# EAGLE schematic 10m02 (EAGLE 6.5.0)
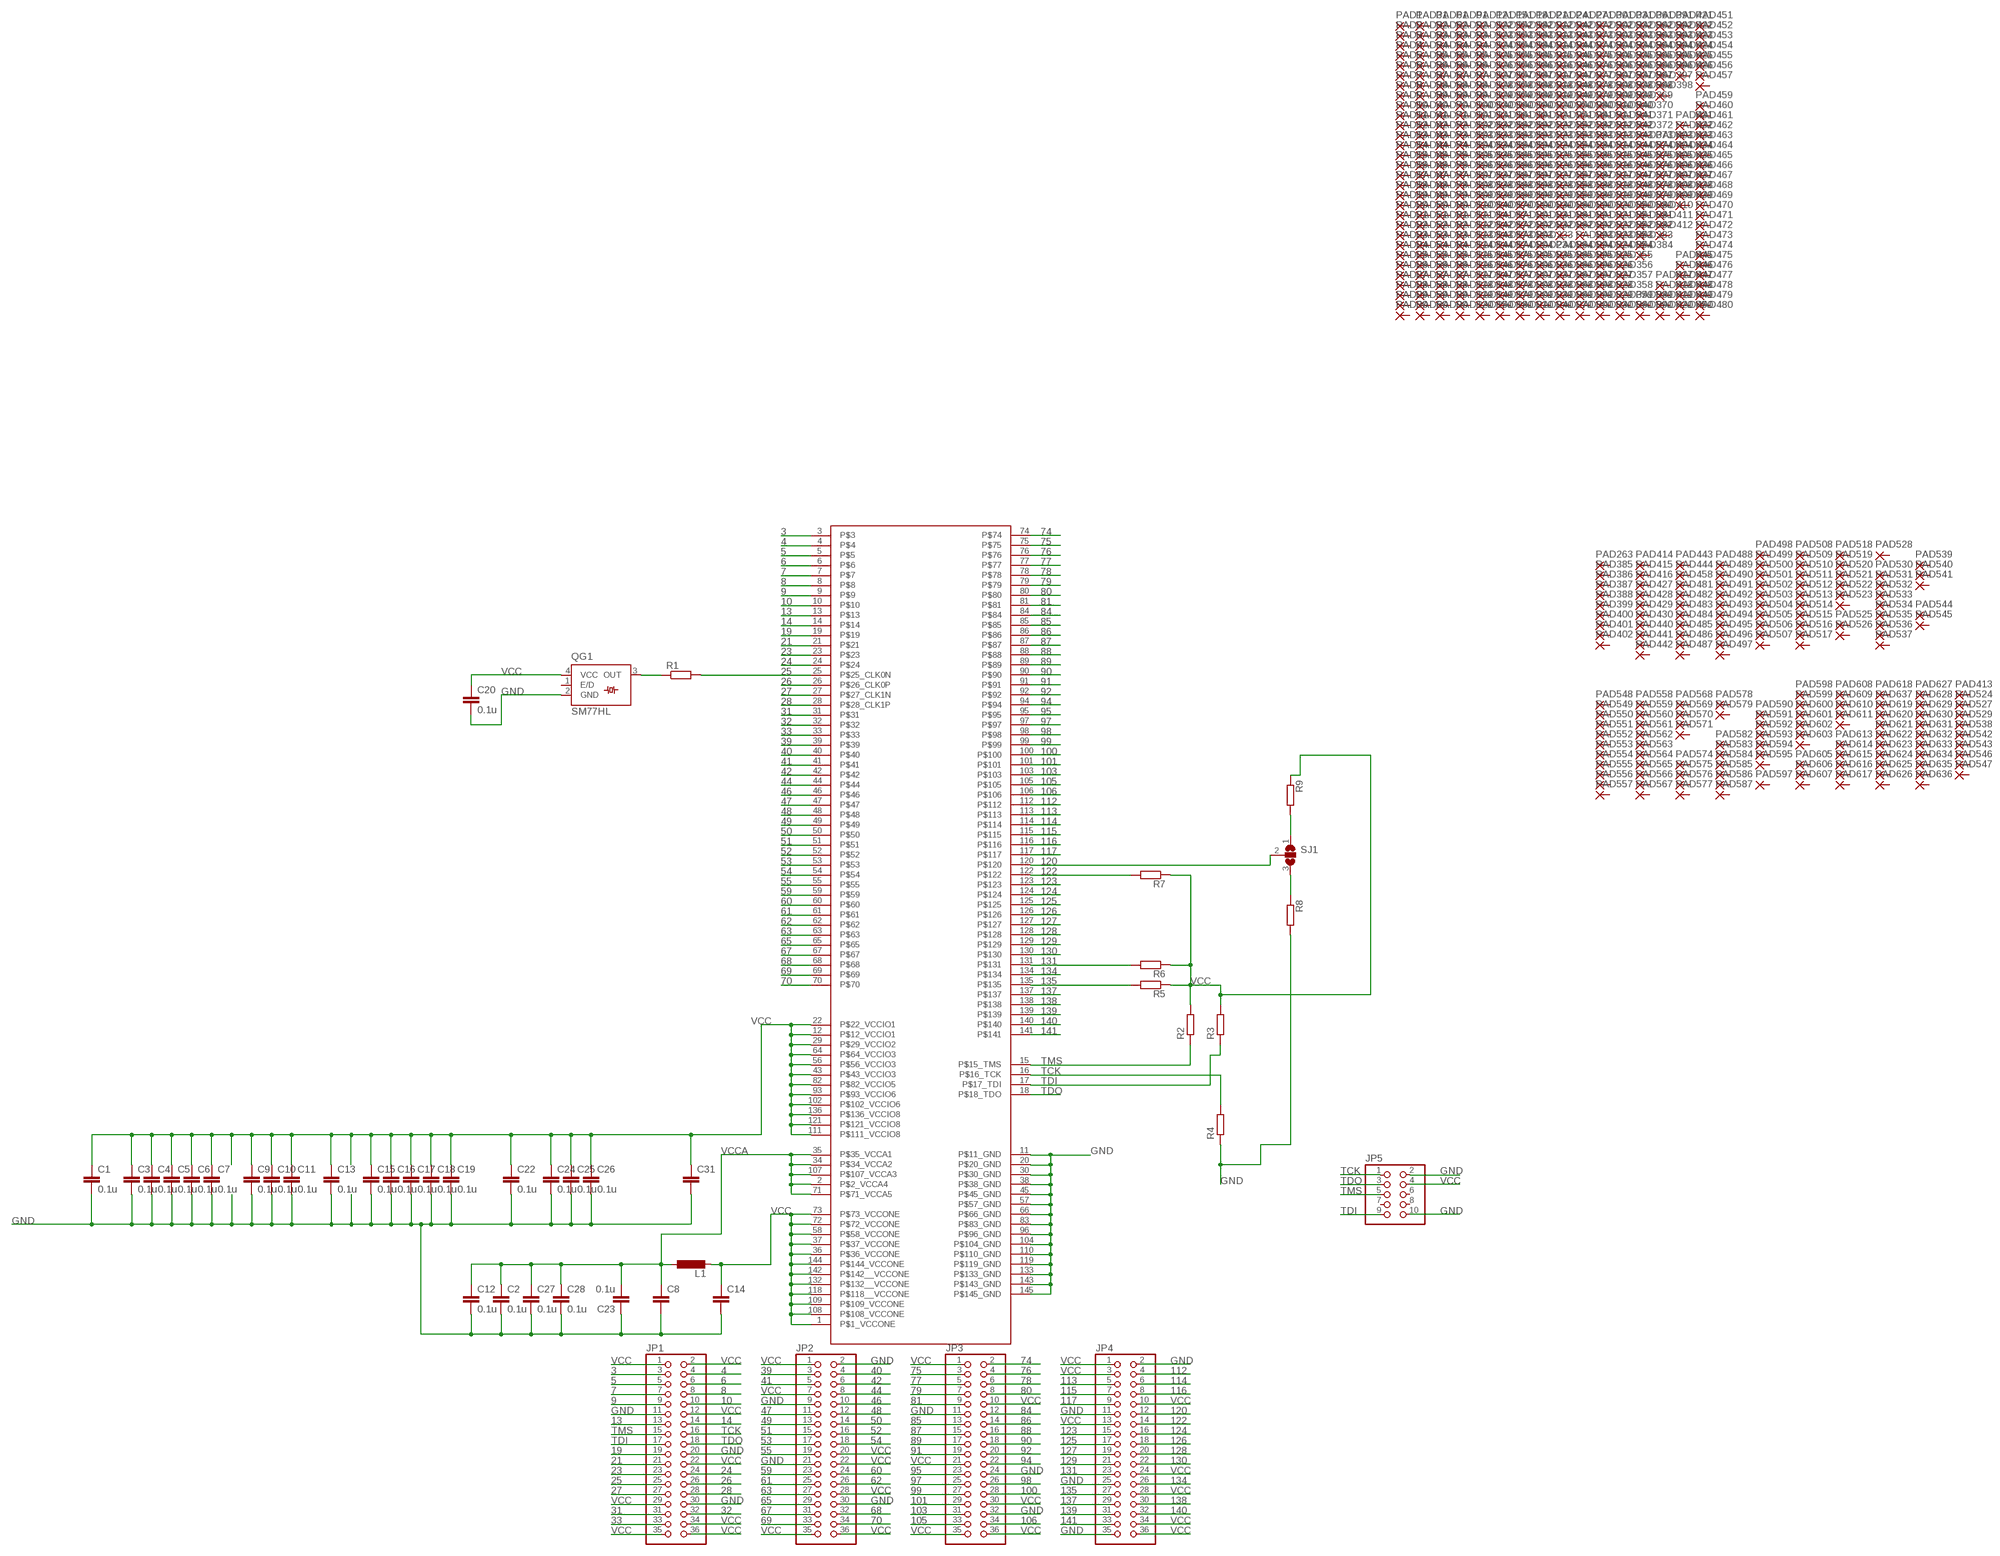
[diagram p0: schematic, sheet 1]

## Parts
C1  0.1u  C-EUC0603K  [C0603K]
C2  0.1u  C-EUC0603K  [C0603K]
C3  0.1u  C-EUC0603K  [C0603K]
C4  0.1u  C-EUC0603K  [C0603K]
C5  0.1u  C-EUC0603K  [C0603K]
C6  0.1u  C-EUC0603K  [C0603K]
C7  0.1u  C-EUC0603K  [C0603K]
C8  C-EUC3216  [C3216]
C9  0.1u  C-EUC0603K  [C0603K]
C10  0.1u  C-EUC0603K  [C0603K]
C11  0.1u  C-EUC0603K  [C0603K]
C12  0.1u  C-EUC0603K  [C0603K]
C13  0.1u  C-EUC0603K  [C0603K]
C14  C-EUC3216  [C3216]
C15  0.1u  C-EUC0603K  [C0603K]
C16  0.1u  C-EUC0603K  [C0603K]
C17  0.1u  C-EUC0603K  [C0603K]
C18  0.1u  C-EUC0603K  [C0603K]
C19  0.1u  C-EUC0603K  [C0603K]
C20  0.1u  C-EUC0603K  [C0603K]
C22  0.1u  C-EUC0603K  [C0603K]
C23  0.1u  C-EUC0603K  [C0603K]
C24  0.1u  C-EUC0603K  [C0603K]
C25  0.1u  C-EUC0603K  [C0603K]
C26  0.1u  C-EUC0603K  [C0603K]
C27  0.1u  C-EUC0603K  [C0603K]
C28  0.1u  C-EUC0603K  [C0603K]
C31  C-EUC3225  [C3225]
IC1  10M02SC144  [TQFP144G]
JP1  PINHD-2X18  [2X18]
JP2  PINHD-2X18  [2X18]
JP3  PINHD-2X18  [2X18]
JP4  PINHD-2X18  [2X18]
JP5  PINHD-2X5  [2X05]
L1  L-EUL3216C  [L3216C]
PAD1  1,6/0,9  [1,6/0,9]
PAD2  1,6/0,9  [1,6/0,9]
PAD3  1,6/0,9  [1,6/0,9]
PAD4  1,6/0,9  [1,6/0,9]
PAD5  1,6/0,9  [1,6/0,9]
PAD6  1,6/0,9  [1,6/0,9]
PAD7  1,6/0,9  [1,6/0,9]
PAD8  1,6/0,9  [1,6/0,9]
PAD9  1,6/0,9  [1,6/0,9]
PAD10  1,6/0,9  [1,6/0,9]
PAD11  1,6/0,9  [1,6/0,9]
PAD12  1,6/0,9  [1,6/0,9]
PAD13  1,6/0,9  [1,6/0,9]
PAD14  1,6/0,9  [1,6/0,9]
PAD15  1,6/0,9  [1,6/0,9]
PAD16  1,6/0,9  [1,6/0,9]
PAD17  1,6/0,9  [1,6/0,9]
PAD18  1,6/0,9  [1,6/0,9]
PAD19  1,6/0,9  [1,6/0,9]
PAD20  1,6/0,9  [1,6/0,9]
PAD21  1,6/0,9  [1,6/0,9]
PAD22  1,6/0,9  [1,6/0,9]
PAD23  1,6/0,9  [1,6/0,9]
PAD24  1,6/0,9  [1,6/0,9]
PAD25  1,6/0,9  [1,6/0,9]
PAD26  1,6/0,9  [1,6/0,9]
PAD27  1,6/0,9  [1,6/0,9]
PAD28  1,6/0,9  [1,6/0,9]
PAD29  1,6/0,9  [1,6/0,9]
PAD30  1,6/0,9  [1,6/0,9]
PAD31  1,6/0,9  [1,6/0,9]
PAD32  1,6/0,9  [1,6/0,9]
PAD33  1,6/0,9  [1,6/0,9]
PAD34  1,6/0,9  [1,6/0,9]
PAD35  1,6/0,9  [1,6/0,9]
PAD36  1,6/0,9  [1,6/0,9]
PAD37  1,6/0,9  [1,6/0,9]
PAD38  1,6/0,9  [1,6/0,9]
PAD39  1,6/0,9  [1,6/0,9]
PAD40  1,6/0,9  [1,6/0,9]
PAD41  1,6/0,9  [1,6/0,9]
PAD42  1,6/0,9  [1,6/0,9]
PAD43  1,6/0,9  [1,6/0,9]
PAD44  1,6/0,9  [1,6/0,9]
PAD45  1,6/0,9  [1,6/0,9]
PAD46  1,6/0,9  [1,6/0,9]
PAD47  1,6/0,9  [1,6/0,9]
PAD48  1,6/0,9  [1,6/0,9]
PAD49  1,6/0,9  [1,6/0,9]
PAD50  1,6/0,9  [1,6/0,9]
PAD51  1,6/0,9  [1,6/0,9]
PAD52  1,6/0,9  [1,6/0,9]
PAD53  1,6/0,9  [1,6/0,9]
PAD54  1,6/0,9  [1,6/0,9]
PAD55  1,6/0,9  [1,6/0,9]
PAD56  1,6/0,9  [1,6/0,9]
PAD57  1,6/0,9  [1,6/0,9]
PAD58  1,6/0,9  [1,6/0,9]
PAD59  1,6/0,9  [1,6/0,9]
PAD60  1,6/0,9  [1,6/0,9]
PAD61  1,6/0,9  [1,6/0,9]
PAD62  1,6/0,9  [1,6/0,9]
PAD63  1,6/0,9  [1,6/0,9]
PAD64  1,6/0,9  [1,6/0,9]
PAD65  1,6/0,9  [1,6/0,9]
PAD66  1,6/0,9  [1,6/0,9]
PAD67  1,6/0,9  [1,6/0,9]
PAD68  1,6/0,9  [1,6/0,9]
PAD69  1,6/0,9  [1,6/0,9]
PAD70  1,6/0,9  [1,6/0,9]
PAD71  1,6/0,9  [1,6/0,9]
PAD72  1,6/0,9  [1,6/0,9]
PAD73  1,6/0,9  [1,6/0,9]
PAD74  1,6/0,9  [1,6/0,9]
PAD75  1,6/0,9  [1,6/0,9]
PAD76  1,6/0,9  [1,6/0,9]
PAD77  1,6/0,9  [1,6/0,9]
PAD78  1,6/0,9  [1,6/0,9]
PAD79  1,6/0,9  [1,6/0,9]
PAD80  1,6/0,9  [1,6/0,9]
PAD81  1,6/0,9  [1,6/0,9]
PAD82  1,6/0,9  [1,6/0,9]
PAD83  1,6/0,9  [1,6/0,9]
PAD84  1,6/0,9  [1,6/0,9]
PAD85  1,6/0,9  [1,6/0,9]
PAD86  1,6/0,9  [1,6/0,9]
PAD87  1,6/0,9  [1,6/0,9]
PAD88  1,6/0,9  [1,6/0,9]
PAD89  1,6/0,9  [1,6/0,9]
PAD90  1,6/0,9  [1,6/0,9]
PAD91  1,6/0,9  [1,6/0,9]
PAD92  1,6/0,9  [1,6/0,9]
PAD93  1,6/0,9  [1,6/0,9]
PAD94  1,6/0,9  [1,6/0,9]
PAD95  1,6/0,9  [1,6/0,9]
PAD96  1,6/0,9  [1,6/0,9]
PAD97  1,6/0,9  [1,6/0,9]
PAD98  1,6/0,9  [1,6/0,9]
PAD99  1,6/0,9  [1,6/0,9]
PAD100  1,6/0,9  [1,6/0,9]
PAD101  1,6/0,9  [1,6/0,9]
PAD102  1,6/0,9  [1,6/0,9]
PAD103  1,6/0,9  [1,6/0,9]
PAD104  1,6/0,9  [1,6/0,9]
PAD105  1,6/0,9  [1,6/0,9]
PAD106  1,6/0,9  [1,6/0,9]
PAD107  1,6/0,9  [1,6/0,9]
PAD108  1,6/0,9  [1,6/0,9]
PAD109  1,6/0,9  [1,6/0,9]
PAD110  1,6/0,9  [1,6/0,9]
PAD111  1,6/0,9  [1,6/0,9]
PAD112  1,6/0,9  [1,6/0,9]
PAD113  1,6/0,9  [1,6/0,9]
PAD114  1,6/0,9  [1,6/0,9]
PAD115  1,6/0,9  [1,6/0,9]
PAD116  1,6/0,9  [1,6/0,9]
PAD117  1,6/0,9  [1,6/0,9]
PAD118  1,6/0,9  [1,6/0,9]
PAD119  1,6/0,9  [1,6/0,9]
PAD120  1,6/0,9  [1,6/0,9]
PAD121  1,6/0,9  [1,6/0,9]
PAD122  1,6/0,9  [1,6/0,9]
PAD123  1,6/0,9  [1,6/0,9]
PAD124  1,6/0,9  [1,6/0,9]
PAD125  1,6/0,9  [1,6/0,9]
PAD126  1,6/0,9  [1,6/0,9]
PAD127  1,6/0,9  [1,6/0,9]
PAD128  1,6/0,9  [1,6/0,9]
PAD129  1,6/0,9  [1,6/0,9]
PAD130  1,6/0,9  [1,6/0,9]
PAD131  1,6/0,9  [1,6/0,9]
PAD132  1,6/0,9  [1,6/0,9]
PAD133  1,6/0,9  [1,6/0,9]
PAD134  1,6/0,9  [1,6/0,9]
PAD135  1,6/0,9  [1,6/0,9]
PAD136  1,6/0,9  [1,6/0,9]
PAD137  1,6/0,9  [1,6/0,9]
PAD138  1,6/0,9  [1,6/0,9]
PAD139  1,6/0,9  [1,6/0,9]
PAD140  1,6/0,9  [1,6/0,9]
PAD141  1,6/0,9  [1,6/0,9]
PAD142  1,6/0,9  [1,6/0,9]
PAD143  1,6/0,9  [1,6/0,9]
PAD144  1,6/0,9  [1,6/0,9]
PAD145  1,6/0,9  [1,6/0,9]
PAD146  1,6/0,9  [1,6/0,9]
PAD147  1,6/0,9  [1,6/0,9]
PAD148  1,6/0,9  [1,6/0,9]
PAD149  1,6/0,9  [1,6/0,9]
PAD150  1,6/0,9  [1,6/0,9]
PAD151  1,6/0,9  [1,6/0,9]
PAD152  1,6/0,9  [1,6/0,9]
PAD153  1,6/0,9  [1,6/0,9]
PAD154  1,6/0,9  [1,6/0,9]
PAD155  1,6/0,9  [1,6/0,9]
PAD156  1,6/0,9  [1,6/0,9]
PAD157  1,6/0,9  [1,6/0,9]
PAD158  1,6/0,9  [1,6/0,9]
PAD159  1,6/0,9  [1,6/0,9]
PAD160  1,6/0,9  [1,6/0,9]
PAD161  1,6/0,9  [1,6/0,9]
PAD162  1,6/0,9  [1,6/0,9]
PAD163  1,6/0,9  [1,6/0,9]
PAD164  1,6/0,9  [1,6/0,9]
PAD165  1,6/0,9  [1,6/0,9]
PAD166  1,6/0,9  [1,6/0,9]
PAD167  1,6/0,9  [1,6/0,9]
PAD168  1,6/0,9  [1,6/0,9]
PAD169  1,6/0,9  [1,6/0,9]
PAD170  1,6/0,9  [1,6/0,9]
PAD171  1,6/0,9  [1,6/0,9]
PAD172  1,6/0,9  [1,6/0,9]
PAD173  1,6/0,9  [1,6/0,9]
PAD174  1,6/0,9  [1,6/0,9]
PAD175  1,6/0,9  [1,6/0,9]
PAD176  1,6/0,9  [1,6/0,9]
PAD177  1,6/0,9  [1,6/0,9]
PAD178  1,6/0,9  [1,6/0,9]
PAD179  1,6/0,9  [1,6/0,9]
PAD180  1,6/0,9  [1,6/0,9]
PAD181  1,6/0,9  [1,6/0,9]
PAD182  1,6/0,9  [1,6/0,9]
PAD183  1,6/0,9  [1,6/0,9]
PAD184  1,6/0,9  [1,6/0,9]
PAD185  1,6/0,9  [1,6/0,9]
PAD186  1,6/0,9  [1,6/0,9]
PAD187  1,6/0,9  [1,6/0,9]
PAD188  1,6/0,9  [1,6/0,9]
PAD189  1,6/0,9  [1,6/0,9]
PAD190  1,6/0,9  [1,6/0,9]
PAD191  1,6/0,9  [1,6/0,9]
PAD192  1,6/0,9  [1,6/0,9]
PAD193  1,6/0,9  [1,6/0,9]
PAD194  1,6/0,9  [1,6/0,9]
PAD195  1,6/0,9  [1,6/0,9]
PAD196  1,6/0,9  [1,6/0,9]
PAD197  1,6/0,9  [1,6/0,9]
PAD198  1,6/0,9  [1,6/0,9]
PAD199  1,6/0,9  [1,6/0,9]
PAD200  1,6/0,9  [1,6/0,9]
PAD201  1,6/0,9  [1,6/0,9]
PAD202  1,6/0,9  [1,6/0,9]
PAD203  1,6/0,9  [1,6/0,9]
PAD204  1,6/0,9  [1,6/0,9]
PAD205  1,6/0,9  [1,6/0,9]
PAD206  1,6/0,9  [1,6/0,9]
PAD207  1,6/0,9  [1,6/0,9]
PAD208  1,6/0,9  [1,6/0,9]
PAD209  1,6/0,9  [1,6/0,9]
PAD210  1,6/0,9  [1,6/0,9]
PAD211  1,6/0,9  [1,6/0,9]
PAD212  1,6/0,9  [1,6/0,9]
PAD213  1,6/0,9  [1,6/0,9]
PAD214  1,6/0,9  [1,6/0,9]
PAD215  1,6/0,9  [1,6/0,9]
PAD216  1,6/0,9  [1,6/0,9]
PAD217  1,6/0,9  [1,6/0,9]
PAD218  1,6/0,9  [1,6/0,9]
PAD219  1,6/0,9  [1,6/0,9]
PAD220  1,6/0,9  [1,6/0,9]
PAD221  1,6/0,9  [1,6/0,9]
PAD222  1,6/0,9  [1,6/0,9]
PAD223  1,6/0,9  [1,6/0,9]
PAD224  1,6/0,9  [1,6/0,9]
PAD225  1,6/0,9  [1,6/0,9]
PAD226  1,6/0,9  [1,6/0,9]
PAD227  1,6/0,9  [1,6/0,9]
PAD228  1,6/0,9  [1,6/0,9]
PAD229  1,6/0,9  [1,6/0,9]
PAD230  1,6/0,9  [1,6/0,9]
PAD231  1,6/0,9  [1,6/0,9]
PAD232  1,6/0,9  [1,6/0,9]
PAD233  1,6/0,9  [1,6/0,9]
PAD234  1,6/0,9  [1,6/0,9]
PAD235  1,6/0,9  [1,6/0,9]
PAD236  1,6/0,9  [1,6/0,9]
PAD237  1,6/0,9  [1,6/0,9]
PAD238  1,6/0,9  [1,6/0,9]
PAD239  1,6/0,9  [1,6/0,9]
PAD240  1,6/0,9  [1,6/0,9]
PAD241  1,6/0,9  [1,6/0,9]
PAD242  1,6/0,9  [1,6/0,9]
PAD243  1,6/0,9  [1,6/0,9]
PAD244  1,6/0,9  [1,6/0,9]
PAD245  1,6/0,9  [1,6/0,9]
PAD246  1,6/0,9  [1,6/0,9]
PAD247  1,6/0,9  [1,6/0,9]
PAD248  1,6/0,9  [1,6/0,9]
PAD249  1,6/0,9  [1,6/0,9]
PAD250  1,6/0,9  [1,6/0,9]
PAD251  1,6/0,9  [1,6/0,9]
PAD252  1,6/0,9  [1,6/0,9]
PAD253  1,6/0,9  [1,6/0,9]
PAD254  1,6/0,9  [1,6/0,9]
PAD255  1,6/0,9  [1,6/0,9]
PAD256  1,6/0,9  [1,6/0,9]
PAD257  1,6/0,9  [1,6/0,9]
PAD258  1,6/0,9  [1,6/0,9]
PAD259  1,6/0,9  [1,6/0,9]
PAD260  1,6/0,9  [1,6/0,9]
PAD261  1,6/0,9  [1,6/0,9]
PAD262  1,6/0,9  [1,6/0,9]
PAD263  SMD2  [SMD1,27-2,54]
PAD264  1,6/0,9  [1,6/0,9]
PAD265  1,6/0,9  [1,6/0,9]
PAD266  1,6/0,9  [1,6/0,9]
PAD267  1,6/0,9  [1,6/0,9]
PAD268  1,6/0,9  [1,6/0,9]
PAD269  1,6/0,9  [1,6/0,9]
PAD270  1,6/0,9  [1,6/0,9]
PAD271  1,6/0,9  [1,6/0,9]
PAD272  1,6/0,9  [1,6/0,9]
PAD273  1,6/0,9  [1,6/0,9]
PAD274  1,6/0,9  [1,6/0,9]
PAD275  1,6/0,9  [1,6/0,9]
PAD276  1,6/0,9  [1,6/0,9]
PAD277  1,6/0,9  [1,6/0,9]
PAD278  1,6/0,9  [1,6/0,9]
PAD279  1,6/0,9  [1,6/0,9]
PAD280  1,6/0,9  [1,6/0,9]
PAD281  1,6/0,9  [1,6/0,9]
PAD282  1,6/0,9  [1,6/0,9]
PAD283  1,6/0,9  [1,6/0,9]
PAD284  1,6/0,9  [1,6/0,9]
PAD285  1,6/0,9  [1,6/0,9]
PAD286  1,6/0,9  [1,6/0,9]
PAD287  1,6/0,9  [1,6/0,9]
PAD288  1,6/0,9  [1,6/0,9]
PAD289  1,6/0,9  [1,6/0,9]
PAD290  1,6/0,9  [1,6/0,9]
PAD291  1,6/0,9  [1,6/0,9]
PAD292  1,6/0,9  [1,6/0,9]
PAD293  1,6/0,9  [1,6/0,9]
PAD294  1,6/0,9  [1,6/0,9]
PAD295  1,6/0,9  [1,6/0,9]
PAD296  1,6/0,9  [1,6/0,9]
PAD297  1,6/0,9  [1,6/0,9]
PAD298  1,6/0,9  [1,6/0,9]
PAD299  1,6/0,9  [1,6/0,9]
PAD300  1,6/0,9  [1,6/0,9]
PAD301  1,6/0,9  [1,6/0,9]
PAD302  1,6/0,9  [1,6/0,9]
PAD303  1,6/0,9  [1,6/0,9]
PAD304  1,6/0,9  [1,6/0,9]
PAD305  1,6/0,9  [1,6/0,9]
PAD306  1,6/0,9  [1,6/0,9]
PAD307  1,6/0,9  [1,6/0,9]
PAD308  1,6/0,9  [1,6/0,9]
PAD309  1,6/0,9  [1,6/0,9]
PAD310  1,6/0,9  [1,6/0,9]
PAD311  1,6/0,9  [1,6/0,9]
PAD312  1,6/0,9  [1,6/0,9]
PAD313  1,6/0,9  [1,6/0,9]
PAD314  1,6/0,9  [1,6/0,9]
PAD315  1,6/0,9  [1,6/0,9]
PAD316  1,6/0,9  [1,6/0,9]
PAD317  1,6/0,9  [1,6/0,9]
PAD318  1,6/0,9  [1,6/0,9]
PAD319  1,6/0,9  [1,6/0,9]
PAD320  1,6/0,9  [1,6/0,9]
PAD321  1,6/0,9  [1,6/0,9]
PAD322  1,6/0,9  [1,6/0,9]
PAD323  1,6/0,9  [1,6/0,9]
PAD324  1,6/0,9  [1,6/0,9]
PAD325  1,6/0,9  [1,6/0,9]
PAD326  1,6/0,9  [1,6/0,9]
PAD327  1,6/0,9  [1,6/0,9]
PAD328  1,6/0,9  [1,6/0,9]
PAD329  1,6/0,9  [1,6/0,9]
PAD330  1,6/0,9  [1,6/0,9]
PAD331  1,6/0,9  [1,6/0,9]
PAD332  1,6/0,9  [1,6/0,9]
PAD333  1,6/0,9  [1,6/0,9]
PAD334  1,6/0,9  [1,6/0,9]
PAD335  1,6/0,9  [1,6/0,9]
PAD336  1,6/0,9  [1,6/0,9]
PAD337  1,6/0,9  [1,6/0,9]
PAD338  1,6/0,9  [1,6/0,9]
PAD339  1,6/0,9  [1,6/0,9]
PAD340  1,6/0,9  [1,6/0,9]
PAD341  1,6/0,9  [1,6/0,9]
PAD342  1,6/0,9  [1,6/0,9]
PAD343  1,6/0,9  [1,6/0,9]
PAD344  1,6/0,9  [1,6/0,9]
PAD345  1,6/0,9  [1,6/0,9]
PAD346  1,6/0,9  [1,6/0,9]
PAD347  1,6/0,9  [1,6/0,9]
PAD348  1,6/0,9  [1,6/0,9]
PAD349  1,6/0,9  [1,6/0,9]
PAD350  1,6/0,9  [1,6/0,9]
PAD351  1,6/0,9  [1,6/0,9]
PAD352  1,6/0,9  [1,6/0,9]
PAD353  1,6/0,9  [1,6/0,9]
PAD354  1,6/0,9  [1,6/0,9]
PAD355  1,6/0,9  [1,6/0,9]
PAD356  1,6/0,9  [1,6/0,9]
PAD357  1,6/0,9  [1,6/0,9]
PAD358  1,6/0,9  [1,6/0,9]
PAD359  1,6/0,9  [1,6/0,9]
PAD360  1,6/0,9  [1,6/0,9]
PAD361  1,6/0,9  [1,6/0,9]
PAD362  1,6/0,9  [1,6/0,9]
PAD363  1,6/0,9  [1,6/0,9]
PAD364  1,6/0,9  [1,6/0,9]
PAD365  1,6/0,9  [1,6/0,9]
PAD366  1,6/0,9  [1,6/0,9]
PAD367  1,6/0,9  [1,6/0,9]
PAD368  1,6/0,9  [1,6/0,9]
PAD369  1,6/0,9  [1,6/0,9]
PAD370  1,6/0,9  [1,6/0,9]
PAD371  1,6/0,9  [1,6/0,9]
PAD372  1,6/0,9  [1,6/0,9]
PAD373  1,6/0,9  [1,6/0,9]
PAD374  1,6/0,9  [1,6/0,9]
PAD375  1,6/0,9  [1,6/0,9]
PAD376  1,6/0,9  [1,6/0,9]
PAD377  1,6/0,9  [1,6/0,9]
PAD378  1,6/0,9  [1,6/0,9]
PAD379  1,6/0,9  [1,6/0,9]
PAD380  1,6/0,9  [1,6/0,9]
PAD381  1,6/0,9  [1,6/0,9]
PAD382  1,6/0,9  [1,6/0,9]
PAD383  1,6/0,9  [1,6/0,9]
PAD384  1,6/0,9  [1,6/0,9]
PAD385  SMD2  [SMD1,27-2,54]
PAD386  SMD2  [SMD1,27-2,54]
PAD387  SMD2  [SMD1,27-2,54]
PAD388  SMD2  [SMD1,27-2,54]
PAD389  1,6/0,9  [1,6/0,9]
PAD390  1,6/0,9  [1,6/0,9]
PAD391  1,6/0,9  [1,6/0,9]
PAD392  1,6/0,9  [1,6/0,9]
PAD393  1,6/0,9  [1,6/0,9]
PAD394  1,6/0,9  [1,6/0,9]
PAD395  1,6/0,9  [1,6/0,9]
PAD396  1,6/0,9  [1,6/0,9]
PAD397  1,6/0,9  [1,6/0,9]
PAD398  1,6/0,9  [1,6/0,9]
PAD399  SMD2  [SMD1,27-2,54]
PAD400  SMD2  [SMD1,27-2,54]
PAD401  SMD2  [SMD1,27-2,54]
PAD402  SMD2  [SMD1,27-2,54]
PAD403  1,6/0,9  [1,6/0,9]
PAD404  1,6/0,9  [1,6/0,9]
PAD405  1,6/0,9  [1,6/0,9]
PAD406  1,6/0,9  [1,6/0,9]
PAD407  1,6/0,9  [1,6/0,9]
PAD408  1,6/0,9  [1,6/0,9]
PAD409  1,6/0,9  [1,6/0,9]
PAD410  1,6/0,9  [1,6/0,9]
PAD411  1,6/0,9  [1,6/0,9]
PAD412  1,6/0,9  [1,6/0,9]
PAD413  SMD2  [SMD1,27-2,54]
PAD414  SMD2  [SMD1,27-2,54]
PAD415  SMD2  [SMD1,27-2,54]
PAD416  SMD2  [SMD1,27-2,54]
PAD417  1,6/0,9  [1,6/0,9]
PAD418  1,6/0,9  [1,6/0,9]
PAD419  1,6/0,9  [1,6/0,9]
PAD420  1,6/0,9  [1,6/0,9]
PAD421  1,6/0,9  [1,6/0,9]
PAD422  1,6/0,9  [1,6/0,9]
PAD423  1,6/0,9  [1,6/0,9]
PAD424  1,6/0,9  [1,6/0,9]
PAD425  1,6/0,9  [1,6/0,9]
PAD426  1,6/0,9  [1,6/0,9]
PAD427  SMD2  [SMD1,27-2,54]
PAD428  SMD2  [SMD1,27-2,54]
PAD429  SMD2  [SMD1,27-2,54]
PAD430  SMD2  [SMD1,27-2,54]
PAD431  1,6/0,9  [1,6/0,9]
PAD432  1,6/0,9  [1,6/0,9]
PAD433  1,6/0,9  [1,6/0,9]
PAD434  1,6/0,9  [1,6/0,9]
PAD435  1,6/0,9  [1,6/0,9]
PAD436  1,6/0,9  [1,6/0,9]
PAD437  1,6/0,9  [1,6/0,9]
PAD438  1,6/0,9  [1,6/0,9]
PAD439  1,6/0,9  [1,6/0,9]
PAD440  SMD2  [SMD1,27-2,54]
PAD441  SMD2  [SMD1,27-2,54]
PAD442  SMD2  [SMD1,27-2,54]
PAD443  SMD2  [SMD1,27-2,54]
PAD444  SMD2  [SMD1,27-2,54]
PAD445  1,6/0,9  [1,6/0,9]
PAD446  1,6/0,9  [1,6/0,9]
PAD447  1,6/0,9  [1,6/0,9]
PAD448  1,6/0,9  [1,6/0,9]
PAD449  1,6/0,9  [1,6/0,9]
PAD450  1,6/0,9  [1,6/0,9]
PAD451  1,6/0,9  [1,6/0,9]
PAD452  1,6/0,9  [1,6/0,9]
PAD453  1,6/0,9  [1,6/0,9]
PAD454  1,6/0,9  [1,6/0,9]
PAD455  1,6/0,9  [1,6/0,9]
PAD456  1,6/0,9  [1,6/0,9]
PAD457  1,6/0,9  [1,6/0,9]
PAD458  SMD2  [SMD1,27-2,54]
PAD459  1,6/0,9  [1,6/0,9]
PAD460  1,6/0,9  [1,6/0,9]
PAD461  1,6/0,9  [1,6/0,9]
PAD462  1,6/0,9  [1,6/0,9]
PAD463  1,6/0,9  [1,6/0,9]
PAD464  1,6/0,9  [1,6/0,9]
PAD465  1,6/0,9  [1,6/0,9]
PAD466  1,6/0,9  [1,6/0,9]
PAD467  1,6/0,9  [1,6/0,9]
PAD468  1,6/0,9  [1,6/0,9]
PAD469  1,6/0,9  [1,6/0,9]
PAD470  1,6/0,9  [1,6/0,9]
PAD471  1,6/0,9  [1,6/0,9]
PAD472  1,6/0,9  [1,6/0,9]
PAD473  1,6/0,9  [1,6/0,9]
PAD474  1,6/0,9  [1,6/0,9]
PAD475  1,6/0,9  [1,6/0,9]
PAD476  1,6/0,9  [1,6/0,9]
PAD477  1,6/0,9  [1,6/0,9]
PAD478  1,6/0,9  [1,6/0,9]
PAD479  1,6/0,9  [1,6/0,9]
PAD480  1,6/0,9  [1,6/0,9]
PAD481  SMD2  [SMD1,27-2,54]
PAD482  SMD2  [SMD1,27-2,54]
PAD483  SMD2  [SMD1,27-2,54]
PAD484  SMD2  [SMD1,27-2,54]
PAD485  SMD2  [SMD1,27-2,54]
PAD486  SMD2  [SMD1,27-2,54]
PAD487  SMD2  [SMD1,27-2,54]
PAD488  SMD2  [SMD1,27-2,54]
PAD489  SMD2  [SMD1,27-2,54]
PAD490  SMD2  [SMD1,27-2,54]
PAD491  SMD2  [SMD1,27-2,54]
PAD492  SMD2  [SMD1,27-2,54]
PAD493  SMD2  [SMD1,27-2,54]
PAD494  SMD2  [SMD1,27-2,54]
PAD495  SMD2  [SMD1,27-2,54]
PAD496  SMD2  [SMD1,27-2,54]
PAD497  SMD2  [SMD1,27-2,54]
PAD498  SMD2  [SMD1,27-2,54]
PAD499  SMD2  [SMD1,27-2,54]
PAD500  SMD2  [SMD1,27-2,54]
PAD501  SMD2  [SMD1,27-2,54]
PAD502  SMD2  [SMD1,27-2,54]
PAD503  SMD2  [SMD1,27-2,54]
PAD504  SMD2  [SMD1,27-2,54]
PAD505  SMD2  [SMD1,27-2,54]
PAD506  SMD2  [SMD1,27-2,54]
PAD507  SMD2  [SMD1,27-2,54]
PAD508  SMD2  [SMD1,27-2,54]
PAD509  SMD2  [SMD1,27-2,54]
PAD510  SMD2  [SMD1,27-2,54]
PAD511  SMD2  [SMD1,27-2,54]
PAD512  SMD2  [SMD1,27-2,54]
PAD513  SMD2  [SMD1,27-2,54]
PAD514  SMD2  [SMD1,27-2,54]
PAD515  SMD2  [SMD1,27-2,54]
PAD516  SMD2  [SMD1,27-2,54]
PAD517  SMD2  [SMD1,27-2,54]
PAD518  SMD2  [SMD1,27-2,54]
PAD519  SMD2  [SMD1,27-2,54]
PAD520  SMD2  [SMD1,27-2,54]
PAD521  SMD2  [SMD1,27-2,54]
PAD522  SMD2  [SMD1,27-2,54]
PAD523  SMD2  [SMD1,27-2,54]
PAD524  SMD2  [SMD1,27-2,54]
PAD525  SMD2  [SMD1,27-2,54]
PAD526  SMD2  [SMD1,27-2,54]
PAD527  SMD2  [SMD1,27-2,54]
PAD528  SMD2  [SMD1,27-2,54]
PAD529  SMD2  [SMD1,27-2,54]
PAD530  SMD2  [SMD1,27-2,54]
PAD531  SMD2  [SMD1,27-2,54]
PAD532  SMD2  [SMD1,27-2,54]
PAD533  SMD2  [SMD1,27-2,54]
PAD534  SMD2  [SMD1,27-2,54]
PAD535  SMD2  [SMD1,27-2,54]
PAD536  SMD2  [SMD1,27-2,54]
PAD537  SMD2  [SMD1,27-2,54]
PAD538  SMD2  [SMD1,27-2,54]
PAD539  SMD2  [SMD1,27-2,54]
PAD540  SMD2  [SMD1,27-2,54]
PAD541  SMD2  [SMD1,27-2,54]
PAD542  SMD2  [SMD1,27-2,54]
PAD543  SMD2  [SMD1,27-2,54]
PAD544  SMD2  [SMD1,27-2,54]
PAD545  SMD2  [SMD1,27-2,54]
PAD546  SMD2  [SMD1,27-2,54]
PAD547  SMD2  [SMD1,27-2,54]
PAD548  SMD2  [SMD1,27-2,54]
PAD549  SMD2  [SMD1,27-2,54]
PAD550  SMD2  [SMD1,27-2,54]
PAD551  SMD2  [SMD1,27-2,54]
PAD552  SMD2  [SMD1,27-2,54]
PAD553  SMD2  [SMD1,27-2,54]
PAD554  SMD2  [SMD1,27-2,54]
PAD555  SMD2  [SMD1,27-2,54]
PAD556  SMD2  [SMD1,27-2,54]
PAD557  SMD2  [SMD1,27-2,54]
PAD558  SMD2  [SMD1,27-2,54]
PAD559  SMD2  [SMD1,27-2,54]
PAD560  SMD2  [SMD1,27-2,54]
PAD561  SMD2  [SMD1,27-2,54]
PAD562  SMD2  [SMD1,27-2,54]
PAD563  SMD2  [SMD1,27-2,54]
PAD564  SMD2  [SMD1,27-2,54]
PAD565  SMD2  [SMD1,27-2,54]
PAD566  SMD2  [SMD1,27-2,54]
PAD567  SMD2  [SMD1,27-2,54]
PAD568  SMD2  [SMD1,27-2,54]
PAD569  SMD2  [SMD1,27-2,54]
PAD570  SMD2  [SMD1,27-2,54]
PAD571  SMD2  [SMD1,27-2,54]
PAD574  SMD2  [SMD1,27-2,54]
PAD575  SMD2  [SMD1,27-2,54]
PAD576  SMD2  [SMD1,27-2,54]
PAD577  SMD2  [SMD1,27-2,54]
PAD578  SMD2  [SMD1,27-2,54]
PAD579  SMD2  [SMD1,27-2,54]
PAD582  SMD2  [SMD1,27-2,54]
PAD583  SMD2  [SMD1,27-2,54]
PAD584  SMD2  [SMD1,27-2,54]
PAD585  SMD2  [SMD1,27-2,54]
PAD586  SMD2  [SMD1,27-2,54]
PAD587  SMD2  [SMD1,27-2,54]
PAD590  SMD2  [SMD1,27-2,54]
PAD591  SMD2  [SMD1,27-2,54]
PAD592  SMD2  [SMD1,27-2,54]
PAD593  SMD2  [SMD1,27-2,54]
PAD594  SMD2  [SMD1,27-2,54]
PAD595  SMD2  [SMD1,27-2,54]
PAD597  SMD2  [SMD1,27-2,54]
PAD598  SMD2  [SMD1,27-2,54]
PAD599  SMD2  [SMD1,27-2,54]
PAD600  SMD2  [SMD1,27-2,54]
PAD601  SMD2  [SMD1,27-2,54]
PAD602  SMD2  [SMD1,27-2,54]
PAD603  SMD2  [SMD1,27-2,54]
PAD605  SMD2  [SMD1,27-2,54]
PAD606  SMD2  [SMD1,27-2,54]
PAD607  SMD2  [SMD1,27-2,54]
PAD608  SMD2  [SMD1,27-2,54]
PAD609  SMD2  [SMD1,27-2,54]
PAD610  SMD2  [SMD1,27-2,54]
PAD611  SMD2  [SMD1,27-2,54]
PAD613  SMD2  [SMD1,27-2,54]
PAD614  SMD2  [SMD1,27-2,54]
PAD615  SMD2  [SMD1,27-2,54]
PAD616  SMD2  [SMD1,27-2,54]
PAD617  SMD2  [SMD1,27-2,54]
PAD618  SMD2  [SMD1,27-2,54]
PAD619  SMD2  [SMD1,27-2,54]
PAD620  SMD2  [SMD1,27-2,54]
PAD621  SMD2  [SMD1,27-2,54]
PAD622  SMD2  [SMD1,27-2,54]
PAD623  SMD2  [SMD1,27-2,54]
PAD624  SMD2  [SMD1,27-2,54]
PAD625  SMD2  [SMD1,27-2,54]
PAD626  SMD2  [SMD1,27-2,54]
PAD627  SMD2  [SMD1,27-2,54]
PAD628  SMD2  [SMD1,27-2,54]
PAD629  SMD2  [SMD1,27-2,54]
PAD630  SMD2  [SMD1,27-2,54]
PAD631  SMD2  [SMD1,27-2,54]
PAD632  SMD2  [SMD1,27-2,54]
PAD633  SMD2  [SMD1,27-2,54]
PAD634  SMD2  [SMD1,27-2,54]
PAD635  SMD2  [SMD1,27-2,54]
PAD636  SMD2  [SMD1,27-2,54]
PAD637  SMD2  [SMD1,27-2,54]
QG1  SM77HL  [SM77HL]
R1  R-EU_R2012W  [R2012W]
R2  R-EU_R2012  [R2012]
R3  R-EU_R2012  [R2012]
R4  R-EU_R2012  [R2012]
R5  R-EU_R2012  [R2012]
R6  R-EU_R2012  [R2012]
R7  R-EU_R2012  [R2012]
R8  R-EU_R2012  [R2012]
R9  R-EU_R2012  [R2012]
SJ1  SJ2W  [SJ_2]

## Nets
3: IC1.3 JP1.3
4: IC1.4 JP1.4
5: IC1.5 JP1.5
6: IC1.6 JP1.6
7: IC1.7 JP1.7
8: IC1.8 JP1.8
9: IC1.9 JP1.9
10: IC1.10 JP1.10
13: IC1.13 JP1.13
14: IC1.14 JP1.14
19: IC1.19 JP1.19
21: IC1.21 JP1.21
23: IC1.23 JP1.23
24: IC1.24 JP1.24
25: IC1.25(P$25_CLK0N) JP1.25 R1.2
26: IC1.26(P$26_CLK0P) JP1.26
27: IC1.27(P$27_CLK1N) JP1.27
28: IC1.28(P$28_CLK1P) JP1.28
31: IC1.31 JP1.31
32: IC1.32 JP1.32
33: IC1.33 JP1.33
39: IC1.39 JP2.3
40: IC1.40 JP2.4
41: IC1.41 JP2.5
42: IC1.42 JP2.6
44: IC1.44 JP2.8
46: IC1.46 JP2.10
47: IC1.47 JP2.11
48: IC1.48 JP2.12
49: IC1.49 JP2.13
50: IC1.50 JP2.14
51: IC1.51 JP2.15
52: IC1.52 JP2.16
53: IC1.53 JP2.17
54: IC1.54 JP2.18
55: IC1.55 JP2.19
59: IC1.59 JP2.23
60: IC1.60 JP2.24
61: IC1.61 JP2.25
62: IC1.62 JP2.26
63: IC1.63 JP2.27
65: IC1.65 JP2.29
67: IC1.67 JP2.31
68: IC1.68 JP2.32
69: IC1.69 JP2.33
70: IC1.70 JP2.34
74: IC1.74 JP3.2
75: IC1.75 JP3.3
76: IC1.76 JP3.4
77: IC1.77 JP3.5
78: IC1.78 JP3.6
79: IC1.79 JP3.7
80: IC1.80 JP3.8
81: IC1.81 JP3.9
84: IC1.84 JP3.12
85: IC1.85 JP3.13
86: IC1.86 JP3.14
87: IC1.87 JP3.15
88: IC1.88 JP3.16
89: IC1.89 JP3.17
90: IC1.90 JP3.18
91: IC1.91 JP3.19
92: IC1.92 JP3.20
94: IC1.94 JP3.22
95: IC1.95 JP3.23
97: IC1.97 JP3.25
98: IC1.98 JP3.26
99: IC1.99 JP3.27
100: IC1.100 JP3.28
101: IC1.101 JP3.29
103: IC1.103 JP3.31
105: IC1.105 JP3.33
106: IC1.106 JP3.34
112: IC1.112 JP4.4
113: IC1.113 JP4.5
114: IC1.114 JP4.6
115: IC1.115 JP4.7
116: IC1.116 JP4.8
117: IC1.117 JP4.9
120: IC1.120 JP4.12 SJ1.2
122: IC1.122 JP4.14 R7.2
123: IC1.123 JP4.15
124: IC1.124 JP4.16
125: IC1.125 JP4.17
126: IC1.126 JP4.18
127: IC1.127 JP4.19
128: IC1.128 JP4.20
129: IC1.129 JP4.21
130: IC1.130 JP4.22
131: IC1.131 JP4.23 R6.2
134: IC1.134 JP4.26
135: IC1.135 JP4.27 R5.2
137: IC1.137 JP4.29
138: IC1.138 JP4.30
139: IC1.139 JP4.31
140: IC1.140 JP4.32
141: IC1.141 JP4.33
GND: C1.2 C2.2 C3.2 C4.2 C5.2 C6.2 C7.2 C8.2 C9.2 C10.2 C11.2 C12.2 C13.2 C14.2 C15.2 C16.2 C17.2 C18.2 C19.2 C20.2 C22.2 C23.1 C24.2 C25.2 C26.2 C27.2 C28.2 C31.2 IC1.11(P$11_GND) IC1.20(P$20_GND) IC1.30(P$30_GND) IC1.38(P$38_GND) IC1.45(P$45_GND) IC1.57(P$57_GND) IC1.66(P$66_GND) IC1.83(P$83_GND) IC1.96(P$96_GND) IC1.104(P$104_GND) IC1.110(P$110_GND) IC1.119(P$119_GND) IC1.133(P$133_GND) IC1.143(P$143_GND) IC1.145(P$145_GND) JP1.11 JP1.20 JP1.30 JP2.2 JP2.9 JP2.21 JP2.30 JP3.11 JP3.24 JP3.32 JP4.2 JP4.11 JP4.25 JP4.35 JP5.2 JP5.10 QG1.2(GND) R4.1 R8.2
N$1: QG1.3(OUT) R1.1
N$10: R9.2 SJ1.1
N$12: R8.1 SJ1.3
TCK: IC1.16(P$16_TCK) JP1.16 JP5.1 R4.2
TDI: IC1.17(P$17_TDI) JP1.17 JP5.9 R3.1
TDO: IC1.18(P$18_TDO) JP1.18 JP5.3
TMS: IC1.15(P$15_TMS) JP1.15 JP5.5 R2.1
VCC: C1.1 C3.1 C4.1 C5.1 C6.1 C7.1 C9.1 C10.1 C11.1 C13.1 C14.1 C15.1 C16.1 C17.1 C18.1 C19.1 C20.1 C22.1 C24.1 C25.1 C26.1 C31.1 IC1.1(P$1_VCCONE) IC1.12(P$12_VCCIO1) IC1.22(P$22_VCCIO1) IC1.29(P$29_VCCIO2) IC1.36(P$36_VCCONE) IC1.37(P$37_VCCONE) IC1.43(P$43_VCCIO3) IC1.56(P$56_VCCIO3) IC1.58(P$58_VCCONE) IC1.64(P$64_VCCIO3) IC1.72(P$72_VCCONE) IC1.73(P$73_VCCONE) IC1.82(P$82_VCCIO5) IC1.93(P$93_VCCIO6) IC1.102(P$102_VCCIO6) IC1.108(P$108_VCCONE) IC1.109(P$109_VCCONE) IC1.111(P$111_VCCIO8) IC1.118(P$118__VCCONE) IC1.121(P$121_VCCIO8) IC1.132(P$132__VCCONE) IC1.136(P$136_VCCIO8) IC1.142(P$142__VCCONE) IC1.144(P$144_VCCONE) JP1.1 JP1.2 JP1.12 JP1.22 JP1.29 JP1.34 JP1.35 JP1.36 JP2.1 JP2.7 JP2.20 JP2.22 JP2.28 JP2.35 JP2.36 JP3.1 JP3.10 JP3.21 JP3.30 JP3.35 JP3.36 JP4.1 JP4.3 JP4.10 JP4.13 JP4.24 JP4.28 JP4.34 JP4.36 JP5.4 L1.2 QG1.4(VCC) R2.2 R3.2 R5.1 R6.1 R7.1 R9.1
VCCA: C2.1 C8.1 C12.1 C23.2 C27.1 C28.1 IC1.2(P$2_VCCA4) IC1.34(P$34_VCCA2) IC1.35(P$35_VCCA1) IC1.71(P$71_VCCA5) IC1.107(P$107_VCCA3) L1.1
Unconnected: JP5.6 JP5.7 JP5.8 PAD1.1(P) PAD2.1(P) PAD3.1(P) PAD4.1(P) PAD5.1(P) PAD6.1(P) PAD7.1(P) PAD8.1(P) PAD9.1(P) PAD10.1(P) PAD11.1(P) PAD12.1(P) PAD13.1(P) PAD14.1(P) PAD15.1(P) PAD16.1(P) PAD17.1(P) PAD18.1(P) PAD19.1(P) PAD20.1(P) PAD21.1(P) PAD22.1(P) PAD23.1(P) PAD24.1(P) PAD25.1(P) PAD26.1(P) PAD27.1(P) PAD28.1(P) PAD29.1(P) PAD30.1(P) PAD31.1(P) PAD32.1(P) PAD33.1(P) PAD34.1(P) PAD35.1(P) PAD36.1(P) PAD37.1(P) PAD38.1(P) PAD39.1(P) PAD40.1(P) PAD41.1(P) PAD42.1(P) PAD43.1(P) PAD44.1(P) PAD45.1(P) PAD46.1(P) PAD47.1(P) PAD48.1(P) PAD49.1(P) PAD50.1(P) PAD51.1(P) PAD52.1(P) PAD53.1(P) PAD54.1(P) PAD55.1(P) PAD56.1(P) PAD57.1(P) PAD58.1(P) PAD59.1(P) PAD60.1(P) PAD61.1(P) PAD62.1(P) PAD63.1(P) PAD64.1(P) PAD65.1(P) PAD66.1(P) PAD67.1(P) PAD68.1(P) PAD69.1(P) PAD70.1(P) PAD71.1(P) PAD72.1(P) PAD73.1(P) PAD74.1(P) PAD75.1(P) PAD76.1(P) PAD77.1(P) PAD78.1(P) PAD79.1(P) PAD80.1(P) PAD81.1(P) PAD82.1(P) PAD83.1(P) PAD84.1(P) PAD85.1(P) PAD86.1(P) PAD87.1(P) PAD88.1(P) PAD89.1(P) PAD90.1(P) PAD91.1(P) PAD92.1(P) PAD93.1(P) PAD94.1(P) PAD95.1(P) PAD96.1(P) PAD97.1(P) PAD98.1(P) PAD99.1(P) PAD100.1(P) PAD101.1(P) PAD102.1(P) PAD103.1(P) PAD104.1(P) PAD105.1(P) PAD106.1(P) PAD107.1(P) PAD108.1(P) PAD109.1(P) PAD110.1(P) PAD111.1(P) PAD112.1(P) PAD113.1(P) PAD114.1(P) PAD115.1(P) PAD116.1(P) PAD117.1(P) PAD118.1(P) PAD119.1(P) PAD120.1(P) PAD121.1(P) PAD122.1(P) PAD123.1(P) PAD124.1(P) PAD125.1(P) PAD126.1(P) PAD127.1(P) PAD128.1(P) PAD129.1(P) PAD130.1(P) PAD131.1(P) PAD132.1(P) PAD133.1(P) PAD134.1(P) PAD135.1(P) PAD136.1(P) PAD137.1(P) PAD138.1(P) PAD139.1(P) PAD140.1(P) PAD141.1(P) PAD142.1(P) PAD143.1(P) PAD144.1(P) PAD145.1(P) PAD146.1(P) PAD147.1(P) PAD148.1(P) PAD149.1(P) PAD150.1(P) PAD151.1(P) PAD152.1(P) PAD153.1(P) PAD154.1(P) PAD155.1(P) PAD156.1(P) PAD157.1(P) PAD158.1(P) PAD159.1(P) PAD160.1(P) PAD161.1(P) PAD162.1(P) PAD163.1(P) PAD164.1(P) PAD165.1(P) PAD166.1(P) PAD167.1(P) PAD168.1(P) PAD169.1(P) PAD170.1(P) PAD171.1(P) PAD172.1(P) PAD173.1(P) PAD174.1(P) PAD175.1(P) PAD176.1(P) PAD177.1(P) PAD178.1(P) PAD179.1(P) PAD180.1(P) PAD181.1(P) PAD182.1(P) PAD183.1(P) PAD184.1(P) PAD185.1(P) PAD186.1(P) PAD187.1(P) PAD188.1(P) PAD189.1(P) PAD190.1(P) PAD191.1(P) PAD192.1(P) PAD193.1(P) PAD194.1(P) PAD195.1(P) PAD196.1(P) PAD197.1(P) PAD198.1(P) PAD199.1(P) PAD200.1(P) PAD201.1(P) PAD202.1(P) PAD203.1(P) PAD204.1(P) PAD205.1(P) PAD206.1(P) PAD207.1(P) PAD208.1(P) PAD209.1(P) PAD210.1(P) PAD211.1(P) PAD212.1(P) PAD213.1(P) PAD214.1(P) PAD215.1(P) PAD216.1(P) PAD217.1(P) PAD218.1(P) PAD219.1(P) PAD220.1(P) PAD221.1(P) PAD222.1(P) PAD223.1(P) PAD224.1(P) PAD225.1(P) PAD226.1(P) PAD227.1(P) PAD228.1(P) PAD229.1(P) PAD230.1(P) PAD231.1(P) PAD232.1(P) PAD233.1(P) PAD234.1(P) PAD235.1(P) PAD236.1(P) PAD237.1(P) PAD238.1(P) PAD239.1(P) PAD240.1(P) PAD241.1(P) PAD242.1(P) PAD243.1(P) PAD244.1(P) PAD245.1(P) PAD246.1(P) PAD247.1(P) PAD248.1(P) PAD249.1(P) PAD250.1(P) PAD251.1(P) PAD252.1(P) PAD253.1(P) PAD254.1(P) PAD255.1(P) PAD256.1(P) PAD257.1(P) PAD258.1(P) PAD259.1(P) PAD260.1(P) PAD261.1(P) PAD262.1(P) PAD263.1(P) PAD264.1(P) PAD265.1(P) PAD266.1(P) PAD267.1(P) PAD268.1(P) PAD269.1(P) PAD270.1(P) PAD271.1(P) PAD272.1(P) PAD273.1(P) PAD274.1(P) PAD275.1(P) PAD276.1(P) PAD277.1(P) PAD278.1(P) PAD279.1(P) PAD280.1(P) PAD281.1(P) PAD282.1(P) PAD283.1(P) PAD284.1(P) PAD285.1(P) PAD286.1(P) PAD287.1(P) PAD288.1(P) PAD289.1(P) PAD290.1(P) PAD291.1(P) PAD292.1(P) PAD293.1(P) PAD294.1(P) PAD295.1(P) PAD296.1(P) PAD297.1(P) PAD298.1(P) PAD299.1(P) PAD300.1(P) PAD301.1(P) PAD302.1(P) PAD303.1(P) PAD304.1(P) PAD305.1(P) PAD306.1(P) PAD307.1(P) PAD308.1(P) PAD309.1(P) PAD310.1(P) PAD311.1(P) PAD312.1(P) PAD313.1(P) PAD314.1(P) PAD315.1(P) PAD316.1(P) PAD317.1(P) PAD318.1(P) PAD319.1(P) PAD320.1(P) PAD321.1(P) PAD322.1(P) PAD323.1(P) PAD324.1(P) PAD325.1(P) PAD326.1(P) PAD327.1(P) PAD328.1(P) PAD329.1(P) PAD330.1(P) PAD331.1(P) PAD332.1(P) PAD333.1(P) PAD334.1(P) PAD335.1(P) PAD336.1(P) PAD337.1(P) PAD338.1(P) PAD339.1(P) PAD340.1(P) PAD341.1(P) PAD342.1(P) PAD343.1(P) PAD344.1(P) PAD345.1(P) PAD346.1(P) PAD347.1(P) PAD348.1(P) PAD349.1(P) PAD350.1(P) PAD351.1(P) PAD352.1(P) PAD353.1(P) PAD354.1(P) PAD355.1(P) PAD356.1(P) PAD357.1(P) PAD358.1(P) PAD359.1(P) PAD360.1(P) PAD361.1(P) PAD362.1(P) PAD363.1(P) PAD364.1(P) PAD365.1(P) PAD366.1(P) PAD367.1(P) PAD368.1(P) PAD369.1(P) PAD370.1(P) PAD371.1(P) PAD372.1(P) PAD373.1(P) PAD374.1(P) PAD375.1(P) PAD376.1(P) PAD377.1(P) PAD378.1(P) PAD379.1(P) PAD380.1(P) PAD381.1(P) PAD382.1(P) PAD383.1(P) PAD384.1(P) PAD385.1(P) PAD386.1(P) PAD387.1(P) PAD388.1(P) PAD389.1(P) PAD390.1(P) PAD391.1(P) PAD392.1(P) PAD393.1(P) PAD394.1(P) PAD395.1(P) PAD396.1(P) PAD397.1(P) PAD398.1(P) PAD399.1(P) PAD400.1(P) PAD401.1(P) PAD402.1(P) PAD403.1(P) PAD404.1(P) PAD405.1(P) PAD406.1(P) PAD407.1(P) PAD408.1(P) PAD409.1(P) PAD410.1(P) PAD411.1(P) PAD412.1(P) PAD413.1(P) PAD414.1(P) PAD415.1(P) PAD416.1(P) PAD417.1(P) PAD418.1(P) PAD419.1(P) PAD420.1(P) PAD421.1(P) PAD422.1(P) PAD423.1(P) PAD424.1(P) PAD425.1(P) PAD426.1(P) PAD427.1(P) PAD428.1(P) PAD429.1(P) PAD430.1(P) PAD431.1(P) PAD432.1(P) PAD433.1(P) PAD434.1(P) PAD435.1(P) PAD436.1(P) PAD437.1(P) PAD438.1(P) PAD439.1(P) PAD440.1(P) PAD441.1(P) PAD442.1(P) PAD443.1(P) PAD444.1(P) PAD445.1(P) PAD446.1(P) PAD447.1(P) PAD448.1(P) PAD449.1(P) PAD450.1(P) PAD451.1(P) PAD452.1(P) PAD453.1(P) PAD454.1(P) PAD455.1(P) PAD456.1(P) PAD457.1(P) PAD458.1(P) PAD459.1(P) PAD460.1(P) PAD461.1(P) PAD462.1(P) PAD463.1(P) PAD464.1(P) PAD465.1(P) PAD466.1(P) PAD467.1(P) PAD468.1(P) PAD469.1(P) PAD470.1(P) PAD471.1(P) PAD472.1(P) PAD473.1(P) PAD474.1(P) PAD475.1(P) PAD476.1(P) PAD477.1(P) PAD478.1(P) PAD479.1(P) PAD480.1(P) PAD481.1(P) PAD482.1(P) PAD483.1(P) PAD484.1(P) PAD485.1(P) PAD486.1(P) PAD487.1(P) PAD488.1(P) PAD489.1(P) PAD490.1(P) PAD491.1(P) PAD492.1(P) PAD493.1(P) PAD494.1(P) PAD495.1(P) PAD496.1(P) PAD497.1(P) PAD498.1(P) PAD499.1(P) PAD500.1(P) PAD501.1(P) PAD502.1(P) PAD503.1(P) PAD504.1(P) PAD505.1(P) PAD506.1(P) PAD507.1(P) PAD508.1(P) PAD509.1(P) PAD510.1(P) PAD511.1(P) PAD512.1(P) PAD513.1(P) PAD514.1(P) PAD515.1(P) PAD516.1(P) PAD517.1(P) PAD518.1(P) PAD519.1(P) PAD520.1(P) PAD521.1(P) PAD522.1(P) PAD523.1(P) PAD524.1(P) PAD525.1(P) PAD526.1(P) PAD527.1(P) PAD528.1(P) PAD529.1(P) PAD530.1(P) PAD531.1(P) PAD532.1(P) PAD533.1(P) PAD534.1(P) PAD535.1(P) PAD536.1(P) PAD537.1(P) PAD538.1(P) PAD539.1(P) PAD540.1(P) PAD541.1(P) PAD542.1(P) PAD543.1(P) PAD544.1(P) PAD545.1(P) PAD546.1(P) PAD547.1(P) PAD548.1(P) PAD549.1(P) PAD550.1(P) PAD551.1(P) PAD552.1(P) PAD553.1(P) PAD554.1(P) PAD555.1(P) PAD556.1(P) PAD557.1(P) PAD558.1(P) PAD559.1(P) PAD560.1(P) PAD561.1(P) PAD562.1(P) PAD563.1(P) PAD564.1(P) PAD565.1(P) PAD566.1(P) PAD567.1(P) PAD568.1(P) PAD569.1(P) PAD570.1(P) PAD571.1(P) PAD574.1(P) PAD575.1(P) PAD576.1(P) PAD577.1(P) PAD578.1(P) PAD579.1(P) PAD582.1(P) PAD583.1(P) PAD584.1(P) PAD585.1(P) PAD586.1(P) PAD587.1(P) PAD590.1(P) PAD591.1(P) PAD592.1(P) PAD593.1(P) PAD594.1(P) PAD595.1(P) PAD597.1(P) PAD598.1(P) PAD599.1(P) PAD600.1(P) PAD601.1(P) PAD602.1(P) PAD603.1(P) PAD605.1(P) PAD606.1(P) PAD607.1(P) PAD608.1(P) PAD609.1(P) PAD610.1(P) PAD611.1(P) PAD613.1(P) PAD614.1(P) PAD615.1(P) PAD616.1(P) PAD617.1(P) PAD618.1(P) PAD619.1(P) PAD620.1(P) PAD621.1(P) PAD622.1(P) PAD623.1(P) PAD624.1(P) PAD625.1(P) PAD626.1(P) PAD627.1(P) PAD628.1(P) PAD629.1(P) PAD630.1(P) PAD631.1(P) PAD632.1(P) PAD633.1(P) PAD634.1(P) PAD635.1(P) PAD636.1(P) PAD637.1(P) QG1.1(E/D)

## Library data of the parts
C1-C20 C22-C28 C31 = resistor:C-EU: CAPACITOR, European symbol
IC1 = altera-max2:10M02SC144
JP1-JP4 = pinhead:PINHD-2X18: PIN HEADER
JP5 = pinhead:PINHD-2X5: PIN HEADER
L1 = resistor:L-EU: INDUCTOR, European symbol
PAD1-PAD262 PAD264-PAD384 PAD389-PAD398 PAD403-PAD412 PAD417-PAD426 PAD431-PAD439 PAD445-PAD457 PAD459-PAD480 = wirepadS:1,6/0,9: THROUGH-HOLE PAD
PAD263 PAD385-PAD388 PAD399-PAD402 PAD413-PAD416 PAD427-PAD430 PAD440-PAD444 PAD458 PAD481-PAD571 PAD574-PAD579 PAD582-PAD587 PAD590-PAD595 PAD597-PAD603 PAD605-PAD611 PAD613-PAD637 = wirepadS:SMD2: SMD PAD
QG1 = crystal:SM77HL
R1-R9 = resistor:R-EU_: RESISTOR, European symbol
SJ1 = jumper:SJ2W: SMD solder JUMPER